# Altium schematic sheet LVHV8ChanTranslation.SchDoc: 8-channel LV to HV Translation
size Letter; Engineer: Nathan Petersen; DocumentNumber: 14; Revision: v1.2; SheetNumber: 14; SheetTotal: 23
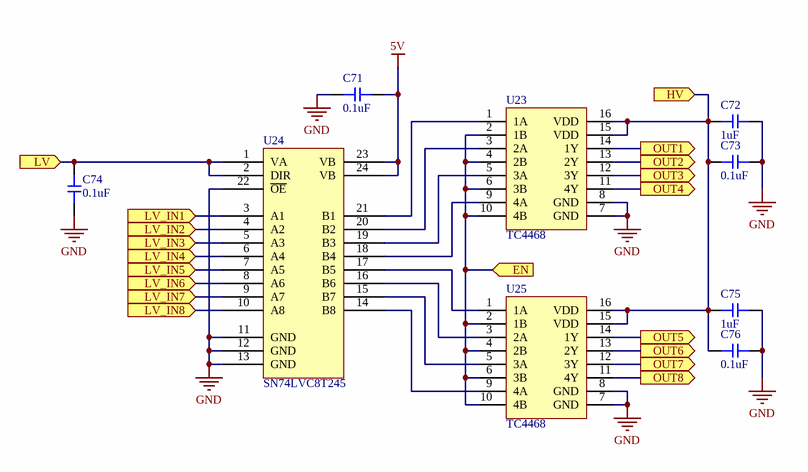
[diagram p0: LVHV8ChanTranslation.SchDoc]

## Parts
C71  value 0.1uF  [0603-CAP]  (hidden comment: Capacitor)
C72  value 1uF  [0603-CAP]  (hidden comment: Capacitor)
C73  value 0.1uF  [0603-CAP]  (hidden comment: Capacitor)
C74  value 0.1uF  [0603-CAP]  (hidden comment: Capacitor)
C75  value 1uF  [0603-CAP]  (hidden comment: Capacitor)
C76  value 0.1uF  [0603-CAP]  (hidden comment: Capacitor)
U23  TC4468  [SOIC16_N - wide]
U24  SN74LVC8T245  [TSOP65P640X120-24N]
U25  TC4468  [SOIC16_N - wide]

## Ports
EN (in), HV (in), LV (in), LV_IN1 (in), LV_IN2 (in), LV_IN3 (in), LV_IN4 (in), LV_IN5 (in), LV_IN6 (in), LV_IN7 (in), LV_IN8 (in), OUT1 (out), OUT2 (out), OUT3 (out), OUT4 (out), OUT5 (out), OUT6 (out), OUT7 (out), OUT8 (out)

## Nets
5V: C71.1 U24.23(VB) U24.24(VB)
GND: C71.2 C72.2 C73.2 C74.1 C75.2 C76.2 U23.7(GND) U23.8(GND) U24.11(GND) U24.12(GND) U24.13(GND) U24.22(~{OE}) U25.7(GND) U25.8(GND)
EN: U23.2(1B) U23.4(2B) U23.6(3B) U23.10(4B) U25.2(1B) U25.4(2B) U25.6(3B) U25.10(4B) ; port EN
HV: C72.1 C73.1 C75.1 C76.1 U23.15(VDD) U23.16(VDD) U25.15(VDD) U25.16(VDD) ; port HV
LV: C74.2 U24.1(VA) U24.2(DIR) ; port LV
LV_IN1: U24.3(A1) ; port LV_IN1
LV_IN2: U24.4(A2) ; port LV_IN2
LV_IN3: U24.5(A3) ; port LV_IN3
LV_IN4: U24.6(A4) ; port LV_IN4
LV_IN5: U24.7(A5) ; port LV_IN5
LV_IN6: U24.8(A6) ; port LV_IN6
LV_IN7: U24.9(A7) ; port LV_IN7
LV_IN8: U24.10(A8) ; port LV_IN8
OUT1: U23.14(1Y) ; port OUT1
OUT2: U23.13(2Y) ; port OUT2
OUT3: U23.12(3Y) ; port OUT3
OUT4: U23.11(4Y) ; port OUT4
OUT5: U25.14(1Y) ; port OUT5
OUT6: U25.13(2Y) ; port OUT6
OUT7: U25.12(3Y) ; port OUT7
OUT8: U25.11(4Y) ; port OUT8
NetU23_1: U23.1(1A) U24.21(B1)
NetU23_3: U23.3(2A) U24.20(B2)
NetU23_5: U23.5(3A) U24.19(B3)
NetU23_9: U23.9(4A) U24.18(B4)
NetU24_14: U24.14(B8) U25.9(4A)
NetU24_15: U24.15(B7) U25.5(3A)
NetU24_16: U24.16(B6) U25.3(2A)
NetU24_17: U24.17(B5) U25.1(1A)

## Notes on the sheet
- Title:
- File:
- Sheet:
- of
- Revision:
- Time:
- Date:
- Engineer:

## Library data of the parts
U23 U25 = TC4468: IC MOSFET DVR QUAD AND 16SOIC; Supplier 1: Digi-Key; Supplier Part Number 1: TC4468COE-ND
U24 = SN74LVC8T245PWR: IC BUS TRANSCVR 8BIT 24TSSOP; Supplier 1: Digi-Key; Supplier Part Number 1: 296-18593-1-ND
C71-C76 = Capacitor: Supplier 1: Digi-Key
  C71 C73 C74 C76: Supplier Part Number 1: 1276-1012-6-ND
  C72 C75: Supplier Part Number 1: 1276-6524-6-ND